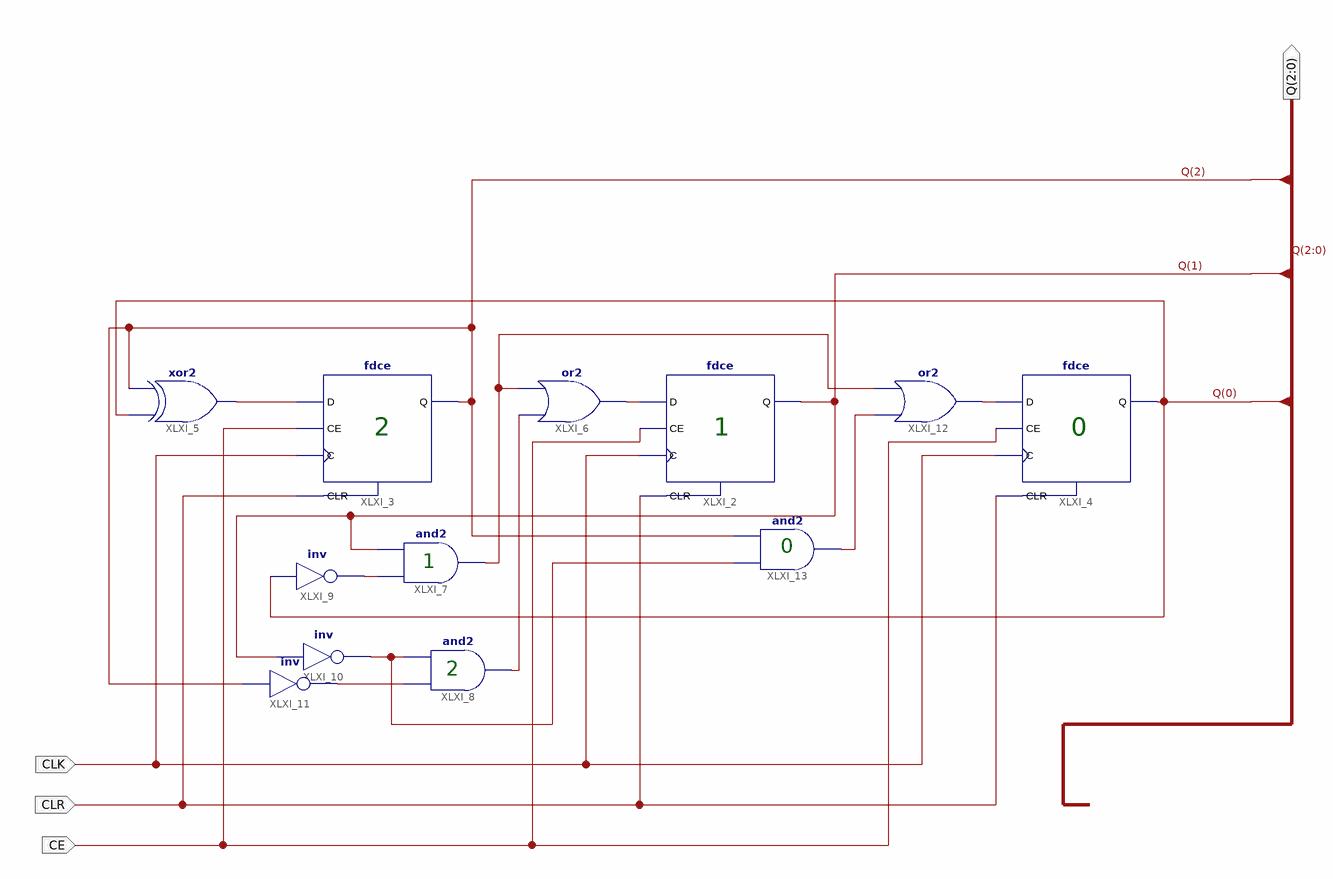
[diagram p0: schematic sheet 1]
// Xilinx ISE schematic licznik.sch (xc9500xl) as structural Verilog: 12 symbols, 4 ports
module licznik (
  input  CLK,
  input  CLR,
  input  CE,
  output [2:0] Q
);

  wire XLXN_1, XLXN_4, XLXN_6, XLXN_7, XLXN_9, XLXN_11, XLXN_12, XLXN_15, XLXN_20;

  fdce XLXI_2 (.C(CLK), .CE(CE), .CLR(CLR), .D(XLXN_4), .Q(Q[1]));
  fdce XLXI_3 (.C(CLK), .CE(CE), .CLR(CLR), .D(XLXN_1), .Q(Q[2]));
  fdce XLXI_4 (.C(CLK), .CE(CE), .CLR(CLR), .D(XLXN_15), .Q(Q[0]));
  xor XLXI_5 (XLXN_1, Q[0], Q[2]);
  or XLXI_6 (XLXN_4, XLXN_6, XLXN_7);
  and XLXI_7 (XLXN_7, XLXN_9, Q[1]);
  and XLXI_8 (XLXN_6, XLXN_12, XLXN_11);
  not XLXI_9 (XLXN_9, Q[0]);
  not XLXI_10 (XLXN_11, Q[1]);
  not XLXI_11 (XLXN_12, Q[2]);
  and XLXI_13 (XLXN_20, XLXN_11, Q[2]);
  or XLXI_12 (XLXN_15, XLXN_20, XLXN_7);

  // Notes on the sheet:
  //   2
  //   1
  //   0
  //   0
  //   1
  //   2
endmodule
